# Altium project PAPI_M2_Control.PrjPcb
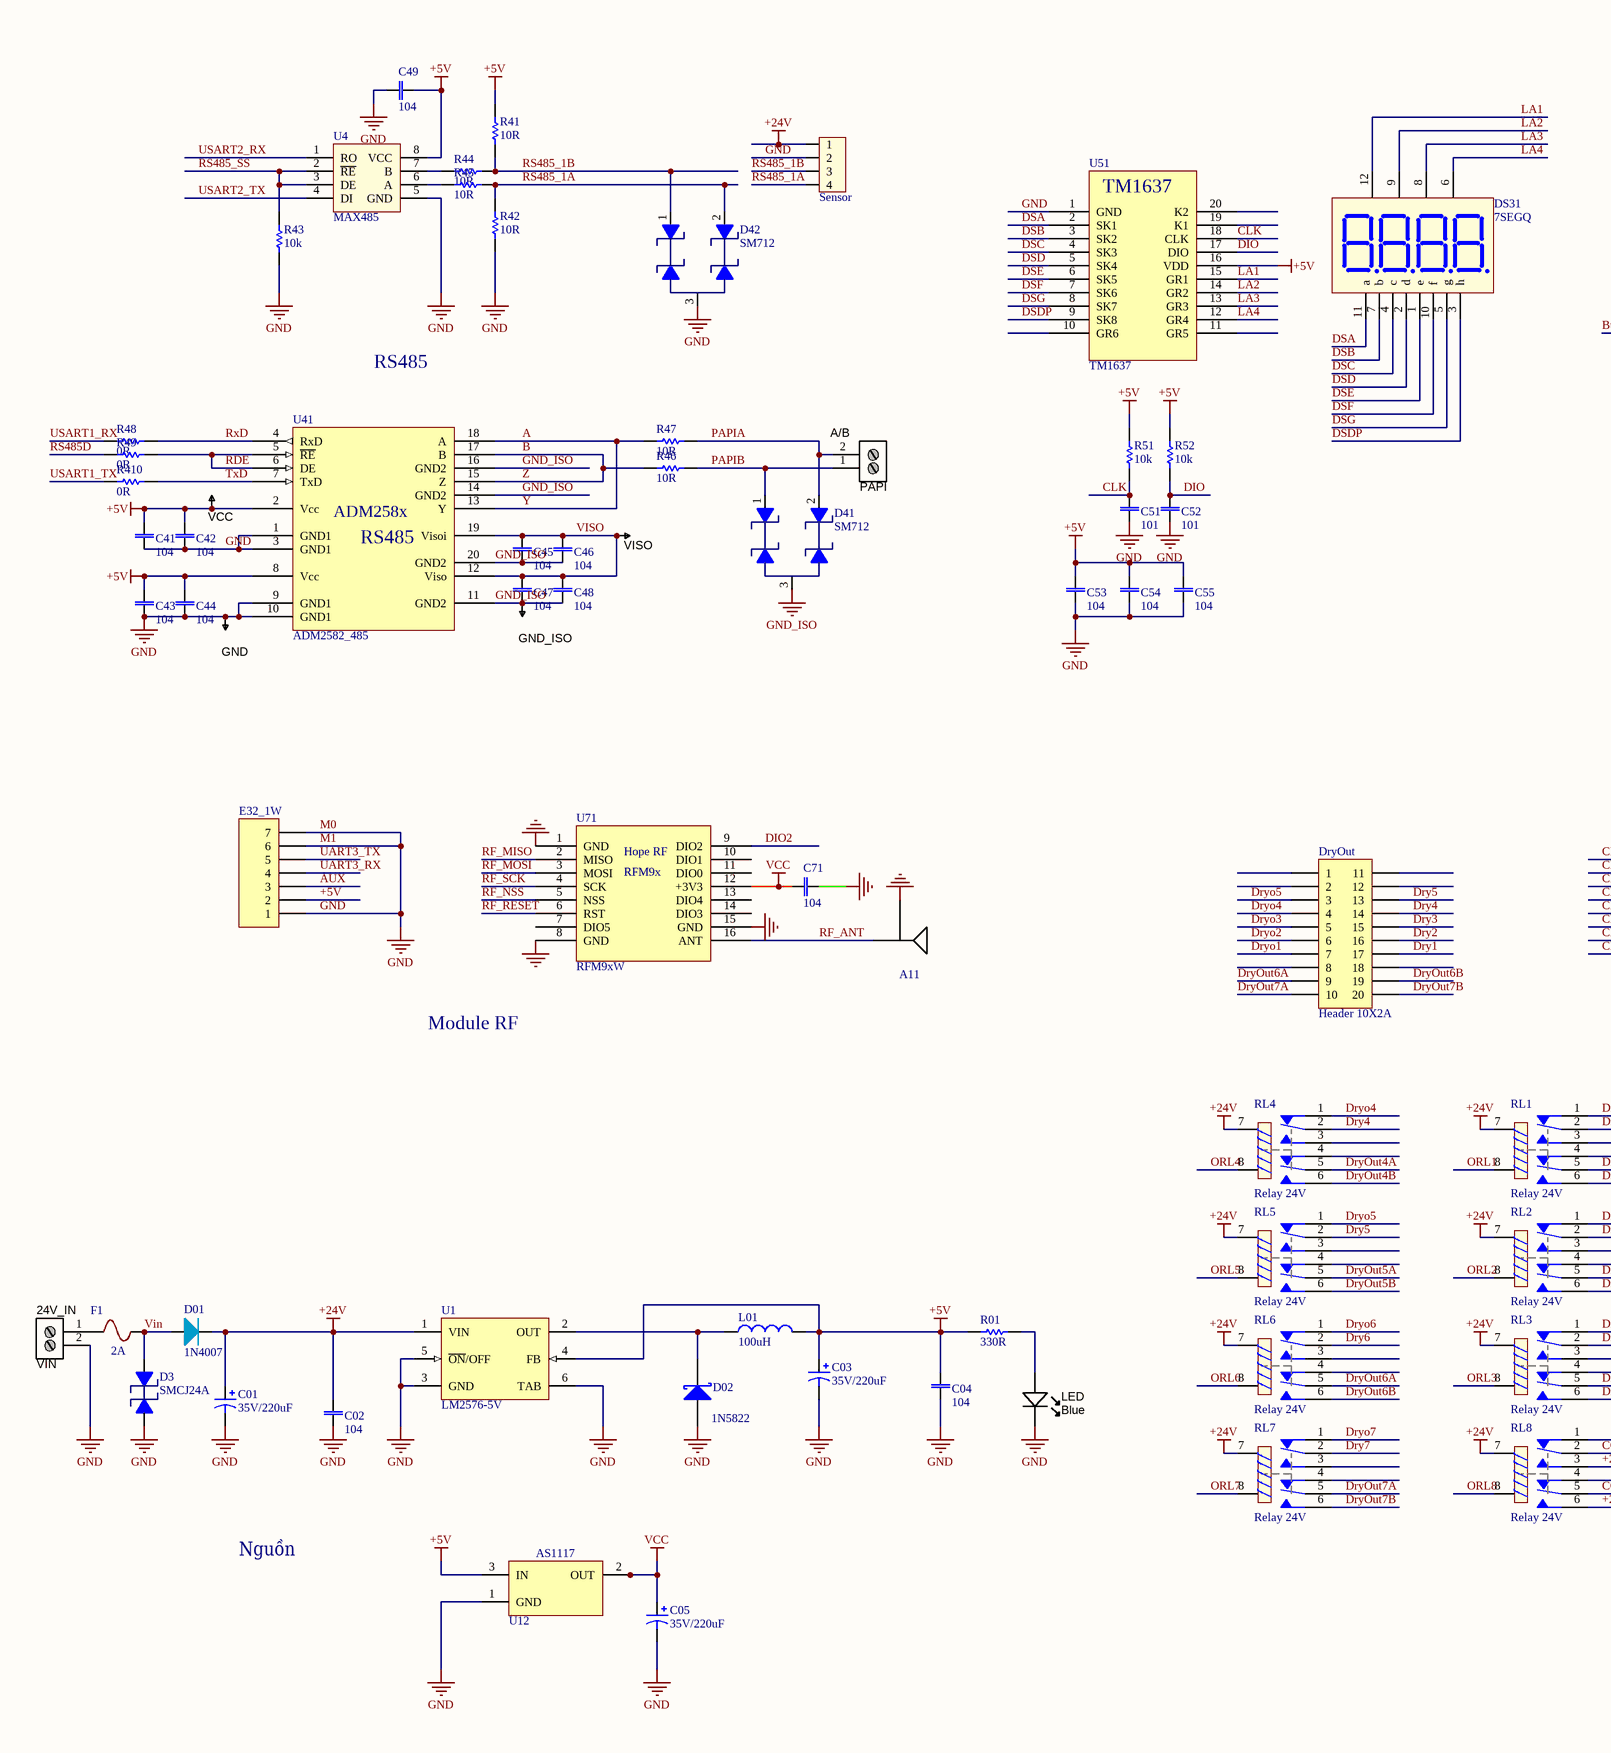
[diagram p0: PAPI_M2_Control.SchDoc, left]
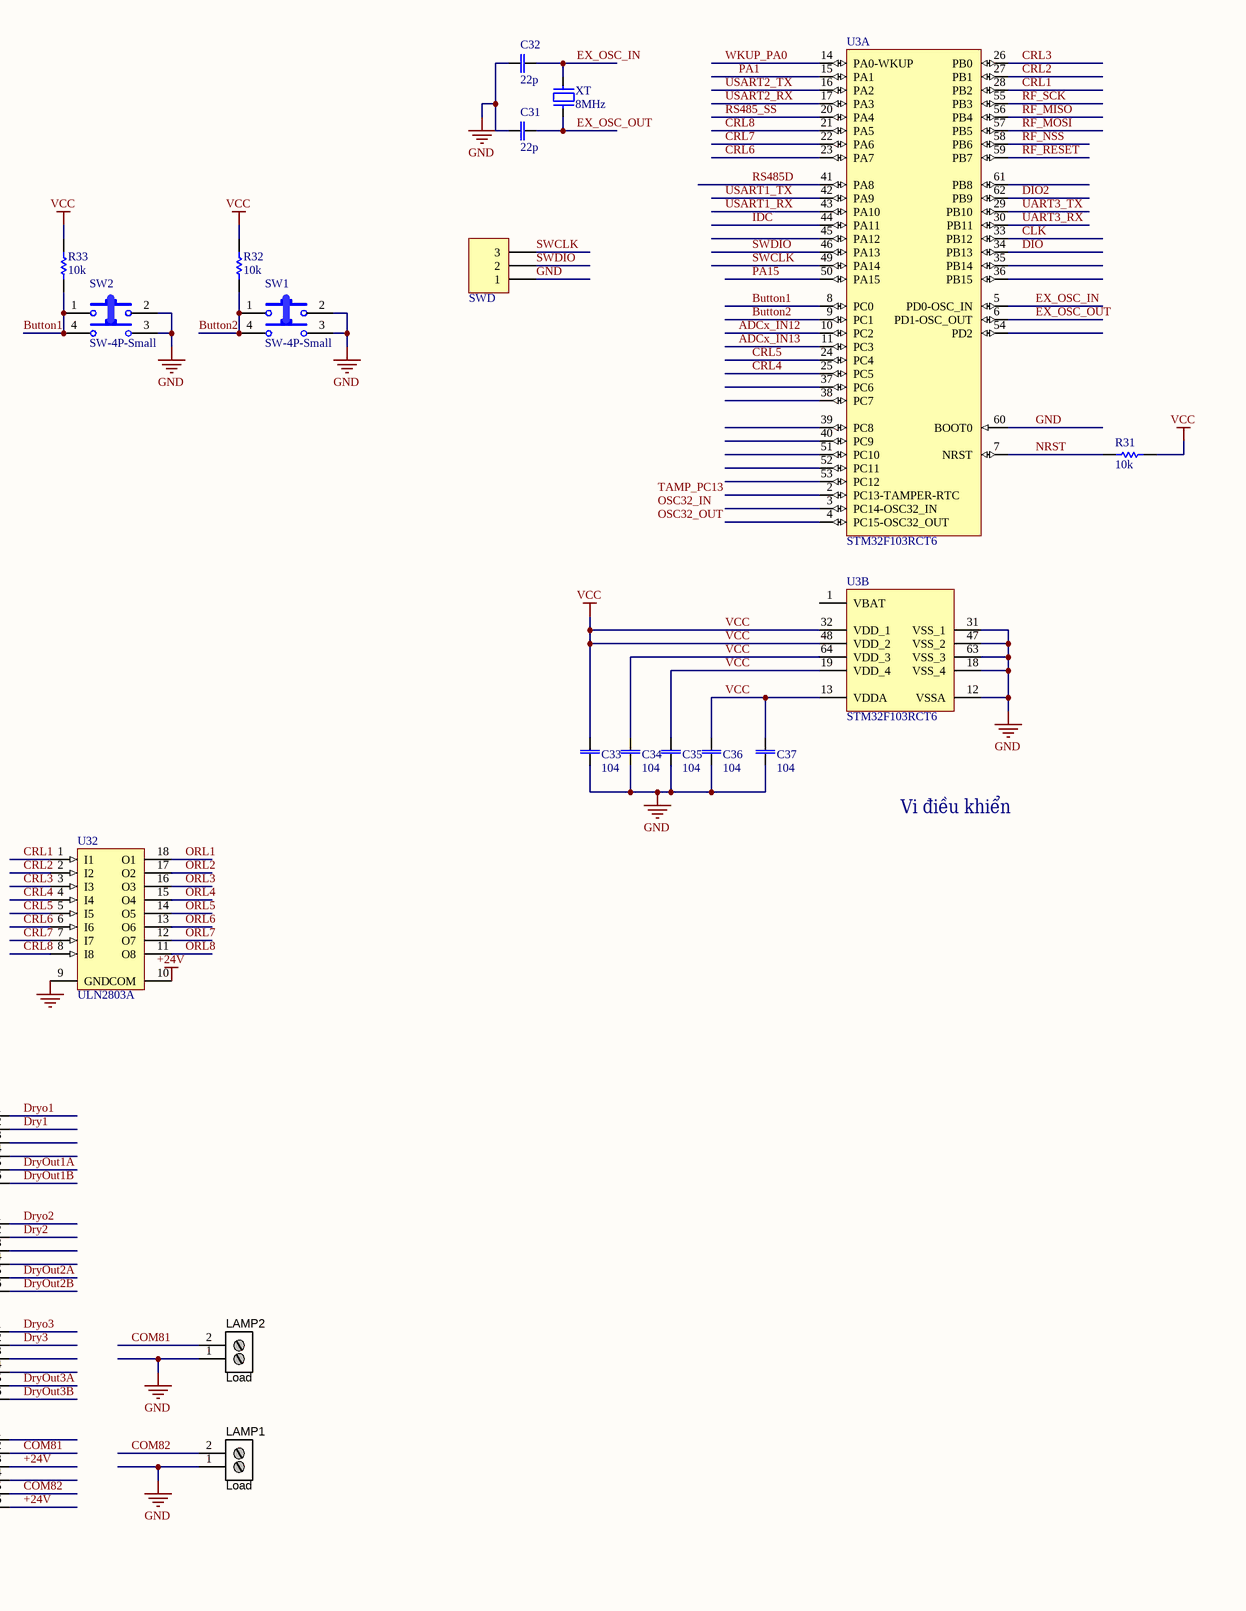
[diagram p1: PAPI_M2_Control.SchDoc, right]
1 sheet, 84 parts. Net scope: global (net labels, ports and power ports of the same name join across sheets).
Board file: PAPI_M2_Control.PcbDoc

## Sheet PAPI_M2_Control.SchDoc
size A2

### Parts
24V_IN  VIN  [2P_PCB1]
A11  Giắc anten SMA  [SMA]  (value not drawn)
C01  value 35V/220uF  [CAPE3.5-5.0MM_Rad_10x14mm]  (hidden comment: Tụ nhôm cắm35V/220uF)
C02  value 104  [CAP 0805]  (hidden comment: Tụ điện dán 0603104)
C03  value 35V/220uF  [CAPE3.5-5.0MM_Rad_10x14mm]  (hidden comment: Tụ nhôm cắm35V/220uF)
C04  value 104  [CAP 0805]  (hidden comment: Tụ điện dán 0603104)
C05  value 35V/220uF  [CAPE3.5-5.0MM_Rad_10x14mm]  (hidden comment: Tụ nhôm cắm35V/220uF)
C31  value 22p  [CAP 0805]  (hidden comment: Tụ điện dán 060322p)
C32  value 22p  [CAP 0805]  (hidden comment: Tụ điện dán 060322p)
C33  value 104  [CAP 0805]  (hidden comment: Tụ điện dán 0603104)
C34  value 104  [CAP 0805]  (hidden comment: Tụ điện dán 0603104)
C35  value 104  [CAP 0805]  (hidden comment: Tụ điện dán 0603104)
C36  value 104  [CAP 0805]  (hidden comment: Tụ điện dán 0603104)
C37  value 104  [CAP 0805]  (hidden comment: Tụ điện dán 0603104)
C41  value 104  [CAP 0805]  (hidden comment: Tụ điện dán 0603104)
C42  value 104  [CAP 0805]  (hidden comment: Tụ điện dán 0603104)
C43  value 104  [CAP 0805]  (hidden comment: Tụ điện dán 0603104)
C44  value 104  [CAP 0805]  (hidden comment: Tụ điện dán 0603104)
C45  value 104  [CAP 0805]  (hidden comment: Tụ điện dán 0603104)
C46  value 104  [CAP 0805]  (hidden comment: Tụ điện dán 0603104)
C47  value 104  [CAP 0805]  (hidden comment: Tụ điện dán 0603104)
C48  value 104  [CAP 0805]  (hidden comment: Tụ điện dán 0603104)
C49  value 104  [CAP 0805]  (hidden comment: Tụ điện dán 0603104)
C51  value 101  [CAP 0805]  (hidden comment: Tụ điện dán 0603101)
C52  value 101  [CAP 0805]  (hidden comment: Tụ điện dán 0603101)
C53  value 104  [CAP 0805]  (hidden comment: Tụ điện dán 0603104)
C54  value 104  [CAP 0805]  (hidden comment: Tụ điện dán 0603104)
C55  value 104  [CAP 0805]  (hidden comment: Tụ điện dán 0603104)
C71  value 104  [CAP 0805]  (hidden comment: Tụ điện dán 0603104)
D01  vl1: 1N4007  [DO-41]  (hidden comment: Đi ốt cắm1N4007)
D02  value 1N5822  [DO-201]  (hidden comment: Đi ốt cắm1N5822)
D3  SMCJ24A  [DO-214AB]
D41  SM712  [SOT23 TOP]
D42  SM712  [SOT23 TOP]
DryOut  Header 10X2A  [HDR2X10_CEN]
DS31  7SEGQ  [7SEGQ]
E32_1W  Header 7  [RF_AS32]  (value not drawn)
F1  2A  [Fuse]
GND  TESTPOINT  [TP-R60]  (value not drawn)  (no BOM)
GND_ISO  TESTPOINT  [TP-R60]  (value not drawn)  (no BOM)
L01  value 100uH  [Inductor 12x12x6]  (hidden comment: Cuộn cảm dán100uH)
LAMP1  Load  [2P_PCB1]
LAMP2  Load  [2P_PCB1]
LED  Blue  [LED-0805-K]
PAPI  A/B  [2P_PCB1]
R01  value 330R  [RES 0805]  (hidden comment: Điện trở dán 0603330R)
R31  value 10k  [RES 0805]  (hidden comment: Điện trở dán 060310k)
R32  value 10k  [RES 0805]  (hidden comment: Điện trở dán 060310k)
R33  value 10k  [RES 0805]  (hidden comment: Điện trở dán 060310k)
R41  value 10R  [RES 0805]  (hidden comment: Điện trở dán 060310R)
R42  value 10R  [RES 0805]  (hidden comment: Điện trở dán 060310R)
R43  value 10k  [RES 0805]  (hidden comment: Điện trở dán 060310k)
R44  value 10R  [RES 0805]  (hidden comment: Điện trở dán 060310R)
R45  value 10R  [RES 0805]  (hidden comment: Điện trở dán 060310R)
R46  value 10R  [RES 0805]  (hidden comment: Điện trở dán 060310R)
R47  value 10R  [RES 0805]  (hidden comment: Điện trở dán 060310R)
R48  value 0R  [RES 0805]  (hidden comment: Điện trở dán 08050R)
R49  value 0R  [RES 0805]  (hidden comment: Điện trở dán 06030R)
R51  value 10k  [RES 0805]  (hidden comment: Điện trở dán 060310k)
R52  value 10k  [RES 0805]  (hidden comment: Điện trở dán 060310k)
R410  value 0R  [RES 0805]  (hidden comment: Điện trở dán 06030R)
RL1  Relay 24V  [RL_DPDT_1A]
RL2  Relay 24V  [RL_DPDT_1A]
RL3  Relay 24V  [RL_DPDT_1A]
RL4  Relay 24V  [RL_DPDT_1A]
RL5  Relay 24V  [RL_DPDT_1A]
RL6  Relay 24V  [RL_DPDT_1A]
RL7  Relay 24V  [RL_DPDT_1A]
RL8  Relay 24V  [RL_DPDT_1A]
Sensor  JP4  [CON4]  (value not drawn)
SW1  SW-4P-Small  [SW]
SW2  SW-4P-Small  [SW]
SWD  Header 3  [HDR1X3]  (value not drawn)
U1  LM2576-5V  [TS5B_N]
U3  STM32F103RCT6  [LQFP64_Tuan]  (parts A,B of 2)
U4  MAX485  [SOIC 8]
U12  AS1117  [SOT223-4N]
U32  ULN2803A  [SOIC-18]
U41  ADM2582_485  [SO-20B]
U51  TM1637  [SOIC-20]
U71  RFM9xW  [RFM9xW]
VCC  TESTPOINT  [TP-R60]  (value not drawn)  (no BOM)
VISO  TESTPOINT  [TP-R60]  (value not drawn)  (no BOM)
XT  8MHz  [XT2]

### Nets
+5V: C03.1 C04.2 C41.2 C42.2 C43.2 C44.2 C49.1 C53.2 C54.2 C55.2 E32_1W.2 L01.2 R01.2 R41.2 R51.2 R52.2 U1.4(FB) U4.8(VCC) U12.3(IN) U41.2(Vcc) U41.8(Vcc) U51.16(VDD) VCC.1
+24V: C01.1 C02.2 D01.K RL1.7 RL2.7 RL3.7 RL4.7 RL5.7 RL6.7 RL7.7 RL8.3 RL8.6 RL8.7 Sensor.1 U1.1(VIN) U32.10(COM)
GND: 24V_IN.2 A11.2(G) C01.2 C02.1 C03.2 C04.1 C05.2 C31.1 C32.1 C33.1 C34.1 C35.1 C36.1 C37.1 C41.1 C42.1 C43.1 C44.1 C49.2 C51.1 C52.1 C53.1 C54.1 C55.1 C71.1 D02.A D3.2 D42.3(GND) E32_1W.1 E32_1W.6 E32_1W.7 GND.1 LAMP1.1 LAMP2.1 LED.K R42.1 R43.1 Sensor.2 SW1.2 SW1.3 SW2.2 SW2.3 SWD.1 U1.3(GND) U1.5(~{ON}/OFF) U1.6(TAB) U3.12(VSSA) U3.18(VSS_4) U3.31(VSS_1) U3.47(VSS_2) U3.60(BOOT0) U3.63(VSS_3) U4.5(GND) U12.1(GND) U32.9(GND) U41.1(GND1) U41.3(GND1) U41.9(GND1) U41.10(GND1) U51.1(GND) U71.1(GND) U71.8(GND) U71.15(GND)  [also labelled M0, M1]
GND_ISO: C45.1 C46.1 C47.1 C48.1 D41.3(GND) GND_ISO.1 U41.11(GND2) U41.14(GND2) U41.16(GND2) U41.20(GND2)
VCC: C05.1 C33.2 C34.2 C35.2 C36.2 C37.2 C71.2 R31.2 R32.2 R33.2 U3.13(VDDA) U3.19(VDD_4) U3.32(VDD_1) U3.48(VDD_2) U3.64(VDD_3) U12.2(OUT) U12.4 U71.12(+3V3)
A: R47.1 U41.13(Y) U41.18(A)  [also labelled Y]
ADCx_IN12: U3.10(PC2)
ADCx_IN13: U3.11(PC3)
AUX: E32_1W.3
B: R46.1 U41.15(Z) U41.17(B)  [also labelled Z]
Button1: R33.1 SW2.1 SW2.4 U3.8(PC0)
Button2: R32.1 SW1.1 SW1.4 U3.9(PC1)
CLK: C51.2 R51.1 U3.33(PB12) U51.18(CLK)
COM81: LAMP2.2 RL8.2
COM82: LAMP1.2 RL8.5
CRL1: U3.28(PB2) U32.1(I1)
CRL2: U3.27(PB1) U32.2(I2)
CRL3: U3.26(PB0) U32.3(I3)
CRL4: U3.25(PC5) U32.4(I4)
CRL5: U3.24(PC4) U32.5(I5)
CRL6: U3.23(PA7) U32.6(I6)
CRL7: U3.22(PA6) U32.7(I7)
CRL8: U3.21(PA5) U32.8(I8)
DIO: C52.2 R52.1 U3.34(PB13) U51.17(DIO)
DIO2: U3.62(PB9) U71.9(DIO2)
Dry1: DryOut.17 RL1.2
Dry2: DryOut.16 RL2.2
Dry3: DryOut.15 RL3.2
Dry4: DryOut.14 RL4.2
Dry5: DryOut.13 RL5.2
Dry6: RL6.2
Dry7: RL7.2
Dryo1: DryOut.7 RL1.1
Dryo2: DryOut.6 RL2.1
Dryo3: DryOut.5 RL3.1
Dryo4: DryOut.4 RL4.1
Dryo5: DryOut.3 RL5.1
Dryo6: RL6.1
Dryo7: RL7.1
DryOut1A: RL1.5
DryOut1B: RL1.6
DryOut2A: RL2.5
DryOut2B: RL2.6
DryOut3A: RL3.5
DryOut3B: RL3.6
DryOut4A: RL4.5
DryOut4B: RL4.6
DryOut5A: RL5.5
DryOut5B: RL5.6
DryOut6A: DryOut.9 RL6.5
DryOut6B: DryOut.19 RL6.6
DryOut7A: DryOut.10 RL7.5
DryOut7B: DryOut.20 RL7.6
DSA: DS31.11(a) U51.2(SK1)
DSB: DS31.7(b) U51.3(SK2)
DSC: DS31.4(c) U51.4(SK3)
DSD: DS31.2(d) U51.5(SK4)
DSDP: DS31.3(h) U51.9(SK8)
DSE: DS31.1(e) U51.6(SK5)
DSF: DS31.10(f) U51.7(SK6)
DSG: DS31.5(g) U51.8(SK7)
EX_OSC_IN: C32.2 U3.5(PD0-OSC_IN) XT.2
EX_OSC_OUT: C31.2 U3.6(PD1-OSC_OUT) XT.1
IDC: U3.44(PA11)
LA1: DS31.12(V1) U51.15(GR1)
LA2: DS31.9(V2) U51.14(GR2)
LA3: DS31.8(V3) U51.13(GR3)
LA4: DS31.6(V4) U51.12(GR4)
NRST: R31.1 U3.7(NRST)
ORL1: RL1.8 U32.18(O1)
ORL2: RL2.8 U32.17(O2)
ORL3: RL3.8 U32.16(O3)
ORL4: RL4.8 U32.15(O4)
ORL5: RL5.8 U32.14(O5)
ORL6: RL6.8 U32.13(O6)
ORL7: RL7.8 U32.12(O7)
ORL8: RL8.8 U32.11(O8)
PA1: U3.15(PA1)
PA15: U3.50(PA15)
PAPIA: D41.2(IO2) PAPI.2 R47.2
PAPIB: D41.1(IO1) PAPI.1 R46.2
RDE: R49.2 U41.5(~{RE}) U41.6(DE)
RF_ANT: A11.1(RF) U71.16(ANT)
RF_MISO: U3.56(PB4) U71.2(MISO)
RF_MOSI: U3.57(PB5) U71.3(MOSI)
RF_NSS: U3.58(PB6) U71.5(NSS)
RF_RESET: U3.59(PB7) U71.6(RST)
RF_SCK: U3.55(PB3) U71.4(SCK)
RS485_1A: D42.2(IO2) R42.2 R45.2 Sensor.4
RS485_1B: D42.1(IO1) R41.1 R44.2 Sensor.3
RS485_SS: R43.2 U3.20(PA4) U4.2(~{RE}) U4.3(DE)
RS485D: R49.1 U3.41(PA8)
RxD: R48.2 U41.4(RxD)
SWCLK: SWD.3 U3.49(PA14)
SWDIO: SWD.2 U3.46(PA13)
TxD: R410.2 U41.7(TxD)
UART3_RX: E32_1W.4 U3.30(PB11)
UART3_TX: E32_1W.5 U3.29(PB10)
USART1_RX: R48.1 U3.43(PA10)
USART1_TX: R410.1 U3.42(PA9)
USART2_RX: U3.17(PA3) U4.1(RO)
USART2_TX: U3.16(PA2) U4.4(DI)
Vin: D01.A D3.1 F1.2
VISO: C45.2 C46.2 C47.2 C48.2 U41.12(Viso) U41.19(Visoi) VISO.1
WKUP_PA0: U3.14(PA0-WKUP)
Net24V_IN_1: 24V_IN.1 F1.1
NetD02_K: D02.K L01.1 U1.2(OUT)
NetLED_A: LED.A R01.1
NetR44_1: R44.1 U4.7(B)
NetR45_1: R45.1 U4.6(A)

Not connected (* = marked no-connect by the designer): DryOut 1 2 8 11 12 18; RL1 3 4; RL2 3 4; RL3 3 4; RL4 3 4; RL5 3 4; RL6 3 4; RL7 3 4; RL8 1 4; U3 1(VBAT) 2(PC13-TAMPER-RTC) 3(PC14-OSC32_IN) 4(PC15-OSC32_OUT) 35(PB14) 36(PB15) 37(PC6) 38(PC7) 39(PC8) 40(PC9) 45(PA12) 51(PC10) 52(PC11) 53(PC12) 54(PD2) 61(PB8); U51 10(GR6) 11(GR5) 19(K1) 20(K2); U71 7(DIO5) 10(DIO1) 11(DIO0) 13(DIO4) 14(DIO3)

### Notes on the sheet
- RS485
- Vi điều khiển
- Module RF
- Nguồn
- Labels drawn without touching a wire or pin: OSC32_IN, OSC32_OUT, TAMP_PC13
- (in symbol ADM2582_485) ADM258x; RS485
- (in symbol RFM9xW) Hope RF; RFM9x

### Library data of the parts
24V_IN LAMP1 LAMP2 PAPI = 2P_ScrewTerm_90S_3.81MM: Terminal Block Screw Type THT 2-Position 3.81mm pitch; Manufacturer 1: Tyco Electronics; Manufacturer Part Number 1: 1776113-2; Value: 2 position; Pitch: 0.150" (3.81mm); Positions Per Level: 2; Package / Case: Side Entry; 3.81mm pitch; Category: Connectors Interconnects; Color: Black; Supplier 1: Digi-Key; Supplier Part Number 1: A97976-ND
A11 = RF_SMA
C01 C03 C05 = Cap: cm: Tụ nhôm cắm
C02 C04 C31-C37 C41-C49 C51-C55 C71 = CAP NP: Capacitor non polarized; cm2: Tụ điện dán 0805; cm3: Tụ điện dán 1206; cm1: Tụ điện dán 0603
D01 = Diode: cm2: Đi ốt dán; vl3: TVS 1.5KE300A 19A 300V; vl4: HER508 5A 1000V; cm1: Đi ốt cắm
D02 = Schottky Diodes: Schottky Diodes Through Hole 3 A 40 V Schottky Diodes, DO-201AD, SB340 ,MBR340; cm2: Đi ốt dán; cm1: Đi ốt cắm
D3 = Diode Zenner: ESD Suppressors / TVS Diodes 24volts 1.5kW 5% Uni-Dir. AEC-Q101; pin to pad: 1>K 2>A
D41 D42 = SM712: The SM712 transient voltage suppressor (TVS) diode  is designed for asymmetrical (12V to -7V) protection  in multi-point data transmission standard RS-485  applications.; pin to pad: 2>3 3>2
DryOut = Header 10X2A: Header, 10-Pin, Dual row; LatestRevisionDate: 17-Jul-2002; LatestRevisionNote: Re-released for DXP Platform.; Publisher: Altium Limited
DS31 = LED7Q: Four 7 Seg Dipslay; Value: LED 7Q SEG
E32_1W = Header 7: Header, 7-Pin; LatestRevisionDate: 17-Jul-2002; LatestRevisionNote: Re-released for DXP Platform.; Publisher: Altium Limited
F1 = Fuse
GND GND_ISO VCC VISO = TESTPOINT: SMD test pin
L01 = Inductor: cm2: Cuộn cảm cắm; cm1: Cuộn cảm dán
LED = LED_SMD_Blue_0805_100mcd: LED 0805 SMD Blue 100mcd 470nm; Manufacturer 1: Ligitek; Manufacturer Part Number 1: LG-170DBKZ-CT; Ratings: 100 mcd; 470 nm; Package / Case: 0805; Material: InGaN/GaN; Value: Blue; Color: Blue
R01 R31-R33 R41-R47 R49 R51 R52 R410 = Res: Resistor; cm2: Điện trở cắm 1/4W; cm3: Điện trở dán 0805; cm4: Điện trở dán 1206; cm1: Điện trở dán 0603
R48 = Res: Resistor; cm1: Điện trở dán 0603; cm2: Điện trở cắm 1/4W; cm4: Điện trở dán 1206; cm3: Điện trở dán 0805
RL1-RL8 = Relay 2: Relay DPDT; pin to pad: 7>8 8>7; Discription: Relay DPDT 5V, 12V - 1A - 5A; Value: Relay - 5V - 1A
Sensor = Con4: Connector 4; Value: Connector 4
SW1 SW2 = SW-4P-Small: pin to pad: 3>2 4>1
SWD = Header 3: Header, 3-Pin; LatestRevisionDate: 17-Jul-2002; LatestRevisionNote: Re-released for DXP Platform.; Publisher: Altium Limited
U1 = LM2596S-ADJ: SIMPLE SWITCHER Power Converter 150 KHz 3A Step-Down Voltage Regulator; Manufacturer: National Semiconductor; PackageTopMarking: NSUZXYTT*LM2596S*-ADJ P+; PowerWise: N; FirstPublished: 4-Dec-2008; DatasheetVersion: May-2002; PackageVersion: revD, Apr-2005; PackageReference: TS5B; Publisher: Altium Limited; PackageDescription: TO-263, Molded, .400 x .390 x .180in, 5 Lead, .067in Pitch, Surface Mount; CompType: Switcher; PartNumber: LM2576-5V; RoHS: O; PinCount: 5; DigiKeyPartNumber: LM2596S-ADJ-ND; Code_JEDEC: MO-169-AB; ComponentLink1Description: LM2596 Datasheet; ComponentLink1URL: http://www.national.com/ds/LM/LM2596.pdf; ComponentLink2Description: LM2596 Web Page; ComponentLink2URL: http://www.national.com/pf/LM/LM2596.html; ComponentLink3Description: TS5B Package Page; ComponentLink3URL: http://www.national.com/packaging/folders/ts5b.html
U3 = STM32F103RCT6: ARM Cortex-M3 32-bit MCU, 256 KB Flash, 48 KB Internal RAM, 51 I/Os, 64-pin LQFP, -40 to 85 degC, Tray; A/D Converter: 3x12-bit (16 Channel); D/A Converter: 2x12-bit (2 Channel); FLASH Size (Prog) (kB): 256; I/Os (High Current): 51; Internal RAM Size (kB): 48; Operating Frequency(F) (Processor speed) (MHz): 72; Supply Voltage(Vcc) min (V): 2; DatasheetVersion: Rev. 8; PackageVersion: Rev. 4, 06/2013; PackageReference: LQFP64; PackageDescription: 64-Pin Low Profile Quad Flat Package, 10 x 10 mm Body, 0.5 mm Pitch; Supplier 1: Digi-Key; Supplier Part Number 1: 497-9033-ND; Supplier 2: Newark; Supplier Part Number 2: 01P4099; Supplier 3: Newark; Supplier Part Number 3: 57P1227; Supplier 4: Mouser; Supplier Part Number 4: 511-STM32F103RCT6; Core: ARM Cortex-M3; Packing: Tray; Mounting Technology: Surface Mount; PartNumber: STM32F103RCT6; ComponentLink1Description: Manufacturer URL; ComponentLink1URL: http://www.st.com/web/en/home.html; ComponentLink2Description: Datasheet; ComponentLink2URL: http://www.st.com/st-web-ui/static/active/en/resource/technical/document/datasheet/CD00191185.pdf; ComponentLink3Description: Package Specification; ComponentLink3URL: http://www.st.com/st-web-ui/static/active/en/resource/technical/document/datasheet/DM00037051.pdf
U4 = MAX485: RS232 - RS485 (Same sn75176)
U32 = ULN2803A: High-Voltage, High-Current Darlington Array; LatestRevisionNote: Stylized 3D Model Added.; Publisher: Altium Limited; Value: ULN2803A
XT = Crystal